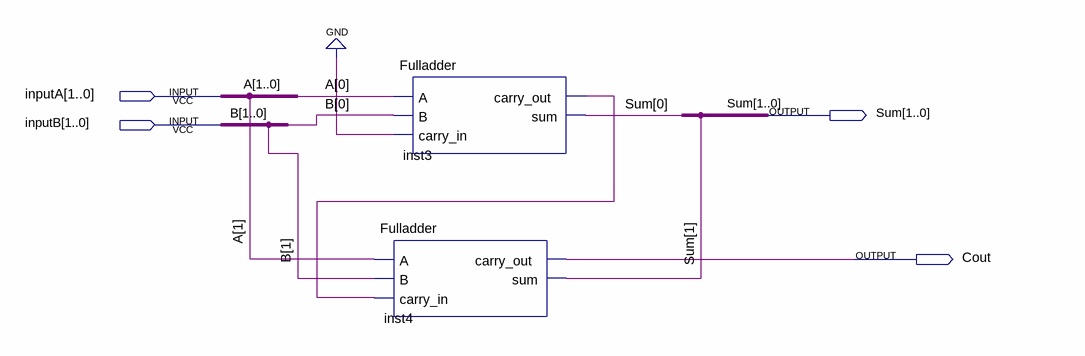
[diagram p0: schematic sheet]
// Quartus schematic CRA.bdf as structural Verilog: 2 symbols, 4 pins
module CRA (
  input  [1:0] inputA,
  input  [1:0] inputB,
  output [1:0] Sum,
  output Cout
);

  wire inst3_carry_out;

  Fulladder inst3 (.A(inputA[0]), .B(inputB[0]), .carry_in(1'b0), .carry_out(inst3_carry_out), .sum(Sum[0]));
  Fulladder inst4 (.A(inputA[1]), .B(inputB[1]), .carry_in(inst3_carry_out), .carry_out(Cout), .sum(Sum[1]));

  // Other names for the same wires on the sheet: B[1:0] = inputB; A[1:0] = inputA
endmodule
